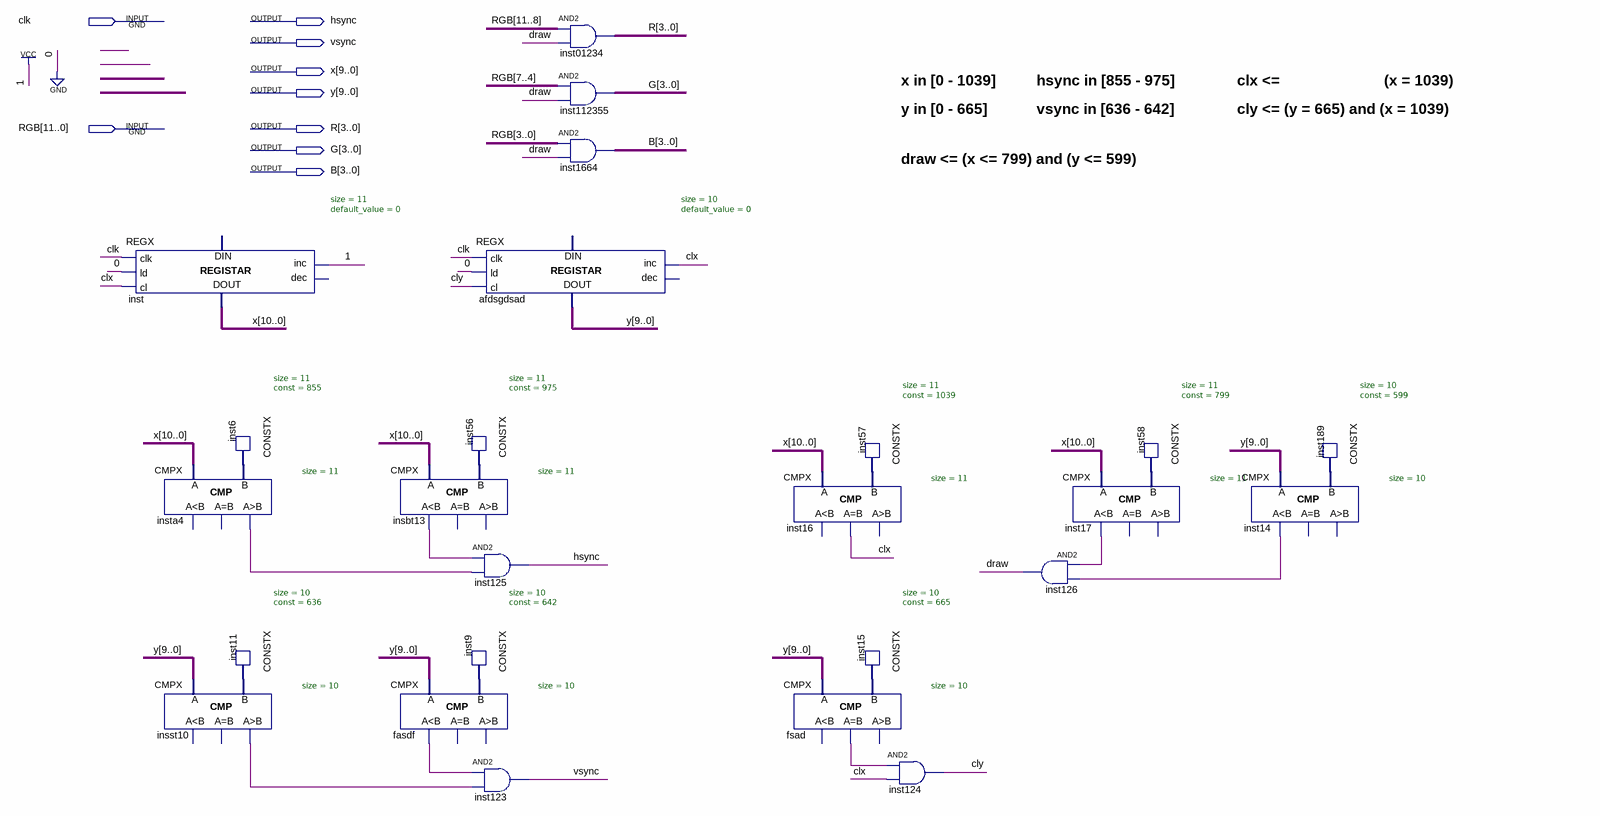
[diagram p0: schematic sheet]
// Quartus schematic DISPLAY.bdf as structural Verilog: 25 symbols, 9 pins
module DISPLAY (
  input  clk,
  input  [11:0] RGB,
  output hsync,
  output vsync,
  output [10:0] x,
  output [9:0] y,
  output [3:0] R,
  output [3:0] G,
  output [3:0] B
);

  wire clx, cly, draw, fasdf_ls, fsad_eq, insbt13_ls, insst10_gr, inst14_ls, inst17_ls, insta4_gr;
  wire [9:0] inst9_data, inst11_data, inst15_data, inst189_data;
  wire [10:0] inst6_data, inst56_data, inst57_data, inst58_data;

  REGX #(.size(11), .default_value(0)) inst (
    .clk(clk), .ld(1'b0), .cl(clx), .inc(1'b1), .data_out(x));  // open: dec, data_in
  CMPX #(.size(11)) insta4 (.A(x), .B(inst6_data), .gr(insta4_gr));  // open: ls, eq
  CMPX #(.size(10)) insst10 (.A(y), .B(inst11_data), .gr(insst10_gr));  // open: ls, eq
  CONSTX #(.size(11), .\const (855)) inst6 (.data(inst6_data));
  CONSTX #(.size(10), .\const (636)) inst11 (.data(inst11_data));
  CMPX #(.size(11)) insbt13 (.A(x), .B(inst56_data), .ls(insbt13_ls));  // open: eq, gr
  CMPX #(.size(10)) fasdf (.A(y), .B(inst9_data), .ls(fasdf_ls));  // open: eq, gr
  REGX #(.size(10), .default_value(0)) afdsgdsad (
    .clk(clk), .ld(1'b0), .cl(cly), .inc(clx), .data_out(y));  // open: dec, data_in
  CONSTX #(.size(11), .\const (975)) inst56 (.data(inst56_data));
  and inst125 (hsync, insbt13_ls, insta4_gr);
  CONSTX #(.size(10), .\const (642)) inst9 (.data(inst9_data));
  and inst123 (vsync, fasdf_ls, insst10_gr);
  assign R = RGB[11:8] & {4{draw}};  // AND2 inst01234, 4 bits wide
  assign G = RGB[7:4] & {4{draw}};  // AND2 inst112355, 4 bits wide
  assign B = RGB[3:0] & {4{draw}};  // AND2 inst1664, 4 bits wide
  CMPX #(.size(11)) inst16 (.A(x), .B(inst57_data), .eq(clx));  // open: ls, gr
  CMPX #(.size(10)) fsad (.A(y), .B(inst15_data), .eq(fsad_eq));  // open: ls, gr
  CONSTX #(.size(11), .\const (1039)) inst57 (.data(inst57_data));
  CONSTX #(.size(10), .\const (665)) inst15 (.data(inst15_data));
  and inst124 (cly, fsad_eq, clx);
  and inst126 (draw, inst17_ls, inst14_ls);
  CMPX #(.size(11)) inst17 (.A(x), .B(inst58_data), .ls(inst17_ls));  // open: eq, gr
  CONSTX #(.size(11), .\const (799)) inst58 (.data(inst58_data));
  CMPX #(.size(10)) inst14 (.A(y), .B(inst189_data), .ls(inst14_ls));  // open: eq, gr
  CONSTX #(.size(10), .\const (599)) inst189 (.data(inst189_data));

  // Notes on the sheet:
  //   x in [0 - 1039]
  //   hsync in [855 - 975]
  //   clx <=                          (x = 1039)
  //   y in [0 - 665]
  //   vsync in [636 - 642]
  //   cly <= (y = 665) and (x = 1039)
  //   draw <= (x <= 799) and (y <= 599)
endmodule
